# EAGLE schematic unicorder-temp-mk-1.1 (EAGLE 6.5.0)
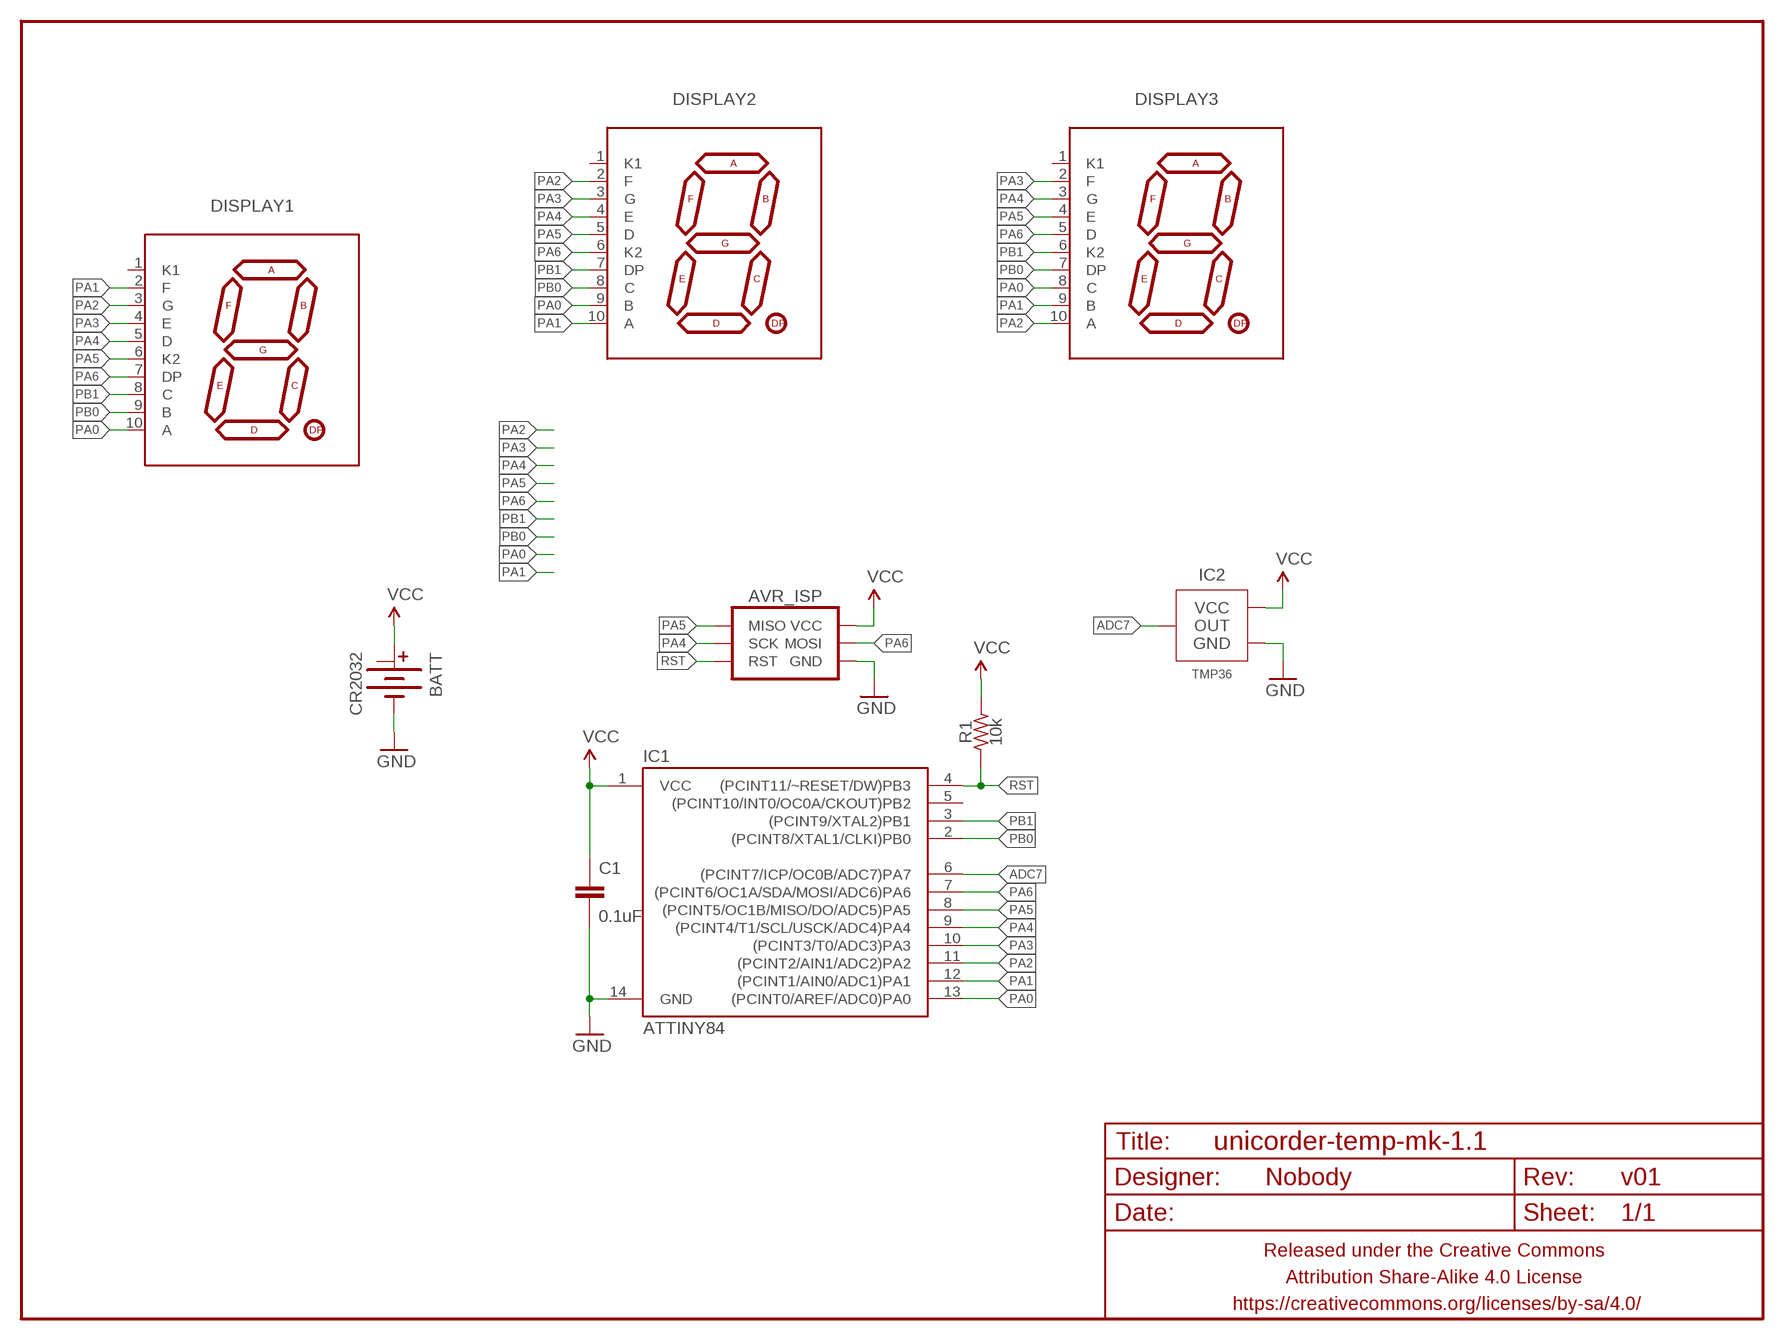
[diagram p0: schematic, sheet 1]

## Parts
AVR_ISP  AVR_SPI_PRG_6PTH  [2X3]
BATT  CR2032  BATTERY-COINCR2032_SMD  [BATTCON_20MM_MINE]
C1  0.1uF  CAPACITOR-CERAMIC025-024X044  [C025-024X044]
DISPLAY1  7SEG_1DIG-2  [7SEG_1DIG_10MM]
DISPLAY2  7SEG_1DIG-2  [7SEG_1DIG_10MM]
DISPLAY3  7SEG_1DIG-2  [7SEG_1DIG_10MM]
FRAME1  FRAME-LETTERNO_PACKAGE  [DUMMY]
IC1  ATTINY84  ATTINY84ATTINY84-20PU  [DIL14]
IC2  TMP36  TMP36TO-92  [TO-92-AMMO]
R1  10k  RESISTORPTH-AXIAL-7.62MM  [RESISTOR-AXIAL-PTH-7.62MM]

## Nets
ADC7: IC1.6((PCINT7/ICP/OC0B/ADC7)PA7) IC2.2(OUT)
GND: AVR_ISP.6(GND) BATT.BOTTOM(-) C1.2 IC1.14(GND) IC2.3(GND)
PA0: DISPLAY1.10(A) DISPLAY2.9(B) DISPLAY3.8(C) IC1.13((PCINT0/AREF/ADC0)PA0)
PA1: DISPLAY1.2(F) DISPLAY2.10(A) DISPLAY3.9(B) IC1.12((PCINT1/AIN0/ADC1)PA1)
PA2: DISPLAY1.3(G) DISPLAY2.2(F) DISPLAY3.10(A) IC1.11((PCINT2/AIN1/ADC2)PA2)
PA3: DISPLAY1.4(E) DISPLAY2.3(G) DISPLAY3.2(F) IC1.10((PCINT3/T0/ADC3)PA3)
PA4: AVR_ISP.3(SCK) DISPLAY1.5(D) DISPLAY2.4(E) DISPLAY3.3(G) IC1.9((PCINT4/T1/SCL/USCK/ADC4)PA4)
PA5: AVR_ISP.1(MISO) DISPLAY1.6(K2) DISPLAY2.5(D) DISPLAY3.4(E) IC1.8((PCINT5/OC1B/MISO/DO/ADC5)PA5)
PA6: AVR_ISP.4(MOSI) DISPLAY1.7(DP) DISPLAY2.6(K2) DISPLAY3.5(D) IC1.7((PCINT6/OC1A/SDA/MOSI/ADC6)PA6)
PB0: DISPLAY1.9(B) DISPLAY2.8(C) DISPLAY3.7(DP) IC1.2((PCINT8/XTAL1/CLKI)PB0)
PB1: DISPLAY1.8(C) DISPLAY2.7(DP) DISPLAY3.6(K2) IC1.3((PCINT9/XTAL2)PB1)
RST: AVR_ISP.5(RST) IC1.4((PCINT11/~RESET/DW)PB3) R1.P$1
VCC: AVR_ISP.2(VCC) BATT.TOP@1(+) C1.1 IC1.1(VCC) IC2.1(VCC) R1.P$2
Unconnected: BATT.TOP@2(+1) DISPLAY1.1(K1) DISPLAY2.1(K1) DISPLAY3.1(K1) IC1.5((PCINT10/INT0/OC0A/CKOUT)PB2)

## Library data of the parts
AVR_ISP = A_butts:AVR_SPI_PRG_6: AVR ISP 6 Pin This is the reduced ISP connector for AVR programming. Common on Arduino. This footprint will take up less PCB space and can be used with a 10-pin to 6-pin adapter such as SKU: BOB-08508 **Special note about "TEST_POINT" package. The stop mask is on the top side, so if you want your programming test points to be on the bottom of your board, make sure to place this package on the bottom side of the board. This also ensure that the orientation to program from the bottom side will be correct.
BATT = A_butts:BATTERY-COIN
C1 = A_butts:CAPACITOR-CERAMIC: CAPACITOR, European symbol
DISPLAY1-DISPLAY3 = A_butts:7SEG_1DIG-2
FRAME1 = A_butts:FRAME-LETTER: Schematic Frame Standard 8.5x11 US Letter frame; DESIGNER: Nobody; VERSION: v01
IC1 = A_butts:ATTINY84: Atmel 14-pin 2/4/8kB flash uC
IC2 = A_butts:TMP36
R1 = A_butts:RESISTOR: RESISTOR, American symbol